# Altium project TIDA-010086_mod.PrjPcb (part 4 of 11)
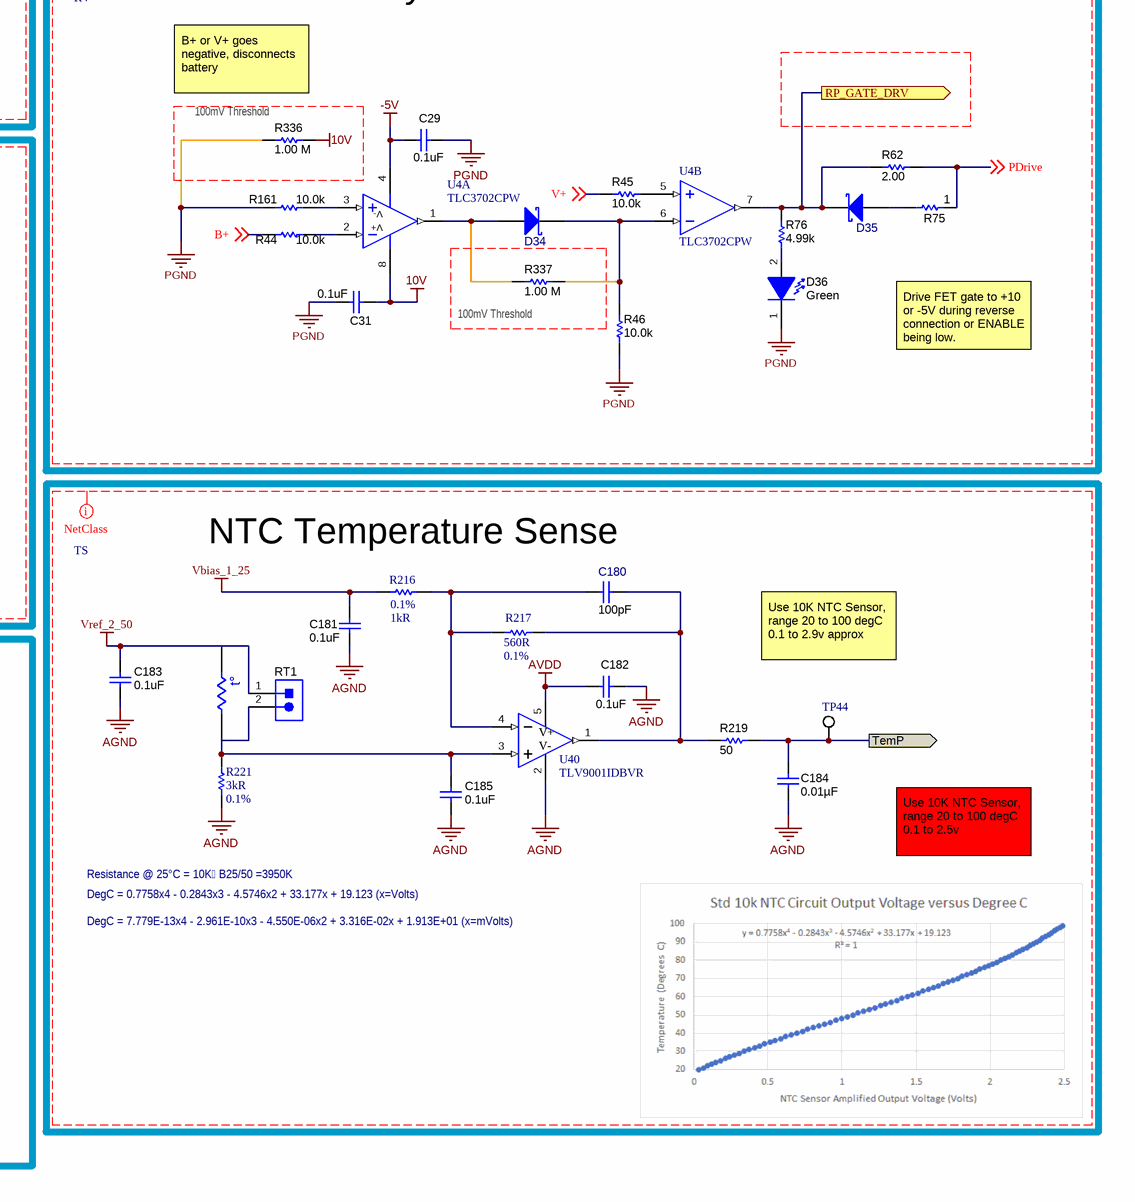
[diagram p120: XTIDA-010086_Power Stage.SchDoc, bottom right]

## Sheet XTIDA-010086_Power Stage.SchDoc: Power Stage (continued)
### Library data of the parts
C1 = C0603C104J3RACTU: CAP, CERM, 0.1 µF, 25 V, +/- 5%, X7R, 0603; Manufacturer: Kemet; Polarized: N; CompType: Capacitor; Value: 0.1uF; U/M: EA; Cap_F: 0.0000001; Tolerance_%: 5; Value1: Unknown; VDC_V: 25; Value2: 25V; TaMin_C: -55; TaMax_C: 125; Cap_Case: 0603; SizeArea_mm2: 1.28; SizeAreaWB_mm2: 4.68; SizeX_mm: 1.6; SizeY_mm: 0.8; SizeZ_mm: 1; AEC Category: Q200; AEC Qualified: Y; SymbolVersion: 2008-07-09; PartNumber: C0603C104J3RACTU; PackageReference: 0603; RoHS: Y; MountType: SMT; Technology: Ceramic; TempCo: X7R; Published: 2008-06-19; Publisher: Texas Instruments; LatestRevisionDate: 2016-09-23; ComponentLink1Description: Datasheet link; ComponentLink1URL: http://www.kemet.com/kemet/web/homepage/kechome.nsf/vapubfiles/F3102_Y5V.pdf/$file/F3102_Y5V.pdf; Supplier 1: Digi-Key; Supplier Part Number 1: 399-1282-1-ND; Supplier 2: Mouser; Supplier Part Number 2: 80-C0603C104J3R; Supplier 3: Farnell; Supplier Part Number 3: 1650833
C2 = GRM1885C1H101JA01D: CAP, CERM, 100 pF, 50 V, +/- 5%, C0G/NP0, 0603; Manufacturer: MuRata; Polarized: N; CompType: Capacitor; Value: 100pF; U/M: EA; Cap_F: 0.0000000001; Tolerance_%: 5; Value1: Unknown; VDC_V: 50; TaMin_C: -55; TaMax_C: 125; Cap_Case: 0603; SizeArea_mm2: 1.28; SizeAreaWB_mm2: 4.68; SizeX_mm: 1.6; SizeY_mm: 0.8; SizeZ_mm: 1; AEC Category: Q200; SymbolVersion: 2008-07-09; PartNumber: GRM1885C1H101JA01D; PackageReference: 0603; RoHS: Y; MountType: SMT; Technology: Ceramic; TempCo: C0G/NP0; Published: 2008-06-19; Publisher: Texas Instruments; LatestRevisionDate: 2016-12-20; ComponentLink1Description: Datasheet link; ComponentLink1URL: http://search.murata.co.jp/Ceramy/PnsearchViewAction.do?HnOFG=ON&HnNFG=ON&SEL_CNT=50&sLang=en&sKey=GRM1885C1H101JA01D&x=9&y=9&search=startwith; Supplier 1: Digi-Key; Supplier Part Number 1: 490-1427-1-ND; Supplier 2: Mouser; Supplier Part Number 2: 81-GRM39C101J50; Supplier 3: Farnell; Supplier Part Number 3: 8819866; AEC Qualified: ?
C3 = 25SVPF330M: 330µF 35V Aluminum Polymer Capacitor Radial, Can - SMD 18mOhm 1000 Hrs @ 125°C; Manufacturer: Panasonic; Polarized: Y; Value: 330uF; U/M: EA; Cap_F: 0.00033; Tolerance_%: 20; Value1: 0.014 ohm; VDC_V: 35; ESR_ohm: 0.014; IRMS_A: 5; TaMin_C: -55; TaMax_C: 105; Cap_Case: F12; SizeAreaWB_mm2: 151.29; SizeArea_mm2: 106.09; SizeX_mm: 10.3; SizeZ_mm: 12.6; AEC Category: Q200; AEC Qualified: N; CompType: Capacitor; SymbolVersion: 2008-07-09; PartNumber: 35SVPK330M; PackageReference: F12, SMD, 2-Leads, Body 10.5x10.5mm, Height 12.7mm; RoHS: Y; MountType: SMT; Technology: Aluminum Polymer; Series: SVPF; SizeY_mm: 10.3; Publisher: Texas Instruments; LatestRevisionDate: 2016-12-22; ComponentLink1Description: Datasheet link; ComponentLink1URL: http://industrial.panasonic.com/www-data/pdf/AAB8000/AAB8000CE1.pdf; Supplier 1: Digi-Key; Supplier Part Number 1: P122136TR-ND; AEC Grade: N/A
C4-C6 = GRM32ER71E226KE15L: CAP, CERM, 22 µF, 25 V, +/- 10%, X7R, 1210; Manufacturer: MuRata; Polarized: N; CompType: Capacitor; Value: 22uF; U/M: EA; Cap_F: 0.000022; Tolerance_%: 10; Value1: Unknown; VDC_V: 25; TaMin_C: -55; TaMax_C: 125; Cap_Case: 1210; SizeArea_mm2: 8; SizeAreaWB_mm2: 14.7; SizeX_mm: 3.2; SizeY_mm: 2.5; SizeZ_mm: 2.7; AEC Category: Q200; SymbolVersion: 2008-07-09; PartNumber: GRM32ER71E226KE15L; PackageReference: 1210; RoHS: Y; MountType: SMT; Technology: Ceramic; TempCo: X7R; Published: 2008-06-19; Publisher: Texas Instruments; LatestRevisionDate: 2016-09-23; ComponentLink1Description: Datasheet link; ComponentLink1URL: http://search.murata.co.jp/Ceramy/PnsearchViewAction.do?HnOFG=ON&HnNFG=ON&SEL_CNT=50&sLang=en&sKey=GRM32ER71E226KE15L&x=9&y=9&search=startwith; Supplier 1: Digi-Key; Supplier Part Number 1: 490-5313-1-ND; Supplier 2: Mouser; Supplier Part Number 2: 81-GRM32ER71E226KE5L; Supplier 3: Farnell; Supplier Part Number 3: 1797019; AEC Qualified: ?
C7 C11 C20 C23 = Capacitor: CAP, CERM, 0.1 uF, 25 V, +/- 5%, X7R, 0603; Manufacturer: AVX; Polarized: N; Value: 0.1uF; U/M: EA; Cap_F: 100nF; ESR_ohm: 0.05; Value1: 0.05 ohm; TaMin_C: -55°C; TaMax_C: 125°C; AEC Category: Q200; SizeArea_mm2: 1.28; SizeAreaWB_mm2: 4.68; SizeX_mm: 1.6; SizeY_mm: 0.8; SizeZ_mm: 1; CompType: Capacitor; PartNumber: 06033C104JAT2A; PackageReference: 0603; RoHS: Y; Tolerance_%: 5%; VDC_V: 25V; MountType: SMT; Technology: Ceramic; TempCo: X7R; Cap_Case: 0603; Published: 2008-06-19; Publisher: Texas Instruments; LatestRevisionDate: 2017-03-09; ComponentLink1Description: Datasheet link; ComponentLink1URL: http://datasheets.avx.com/X7RDielectric.pdf; Supplier 1: Digi-Key; Supplier Part Number 1: 478-3713-1-ND; Supplier 2: Mouser; Supplier Part Number 2: 581-06033C104JAT2A; Supplier 3: Farnell; Supplier Part Number 3: 1740614; AEC Qualified: N; AEC Grade: N/A
C8 C18 C24 C52 = Capacitor: CAP, CERM, 1 uF, 25 V, +/- 10%, X7R, 0603; Manufacturer: MuRata; Polarized: N; Value: 1uF; U/M: EA; Cap_F: 1µF; Value1: Unknown; TaMin_C: -55°C; TaMax_C: 125°C; AEC Category: Q200; SizeArea_mm2: 1.28; SizeAreaWB_mm2: 4.68; SizeX_mm: 1.6; SizeY_mm: 0.8; SizeZ_mm: 1; CompType: Capacitor; PartNumber: GRM188R71E105KA12D; PackageReference: 0603; RoHS: Y; Tolerance_%: 10%; MountType: SMT; Technology: Ceramic; TempCo: X7R; Cap_Case: 0603; Published: 2008-06-19; Publisher: Texas Instruments; LatestRevisionDate: 2017-03-09; ComponentLink1Description: Datasheet link; ComponentLink1URL: http://search.murata.co.jp/Ceramy/PnsearchViewAction.do?HnOFG=ON&HnNFG=ON&SEL_CNT=50&sLang=en&sKey=GRM188R71E105KA12D&x=9&y=9&search=startwith; Supplier 1: Digi-Key; Supplier Part Number 1: 490-5307-1-ND; Supplier 2: Mouser; Supplier Part Number 2: 81-GRM188R71E105KA2D; Supplier 3: Farnell; Supplier Part Number 3: 1735540; AEC Qualified: ?
  C8 C18: Value2: 25V
  C24 C52: VDC_V: 25V; Parameter 1: *
C9 C10 = 10SVP560M: 560µF 20V Aluminum Polymer Capacitor Radial, Can - SMD 12mOhm 1000 Hrs @ 125°C; Manufacturer: Panasonic; Polarized: Y; Value: 560uF; U/M: EA; Cap_F: 0.00056; Tolerance_%: 20; Value1: 0.013 ohm; ESR_ohm: 0.013; IRMS_A: 5.23; TaMin_C: -55; TaMax_C: 105; Cap_Case: 10.3x10.3x12.6; SizeAreaWB_mm2: 159.9; SizeArea_mm2: 113.3; SizeX_mm: 11; SizeY_mm: 10.3; SizeZ_mm: 7.7; AEC Category: Q200; CompType: Capacitor; SymbolVersion: 2008-07-09; PartNumber: 20SVF560M; PackageReference: 10x10.3; RoHS: Y; VDC_V: 20; MountType: SMT; Technology: Aluminum Polymer; Series: SVP; Publisher: Texas Instruments; LatestRevisionDate: 2016-09-20; ComponentLink1Description: Datasheet link; ComponentLink1URL: https://industrial.panasonic.com/content/data/CP/PDF/OS-CON/S_OS-CON_SVP_e.pdf; Supplier 1: Digi-Key; Supplier Part Number 1: P122119TR-ND; AEC Qualified: ?
C12 C13 = GRM32ER71A476ME15L: CAP, CERM, 47 µF, 10 V, +/- 20%, X7R, 1210; Manufacturer: MuRata; Polarized: N; CompType: Capacitor; Value: 47uF; U/M: EA; Cap_F: 0.000047; Tolerance_%: 20; Value1: Unknown; VDC_V: 10; TaMin_C: -55; TaMax_C: 125; Cap_Case: 1210; SizeArea_mm2: 8; SizeAreaWB_mm2: 14.7; SizeX_mm: 3.2; SizeY_mm: 2.5; SizeZ_mm: 2.7; AEC Category: Q200; SymbolVersion: 2008-07-09; PartNumber: GRM32ER71A476ME15L; PackageReference: 1210; RoHS: Y; MountType: SMT; Technology: Ceramic; TempCo: X7R; Published: 2008-06-19; Publisher: Texas Instruments; LatestRevisionDate: 2016-09-23; ComponentLink1Description: Datasheet link; ComponentLink1URL: http://search.murata.co.jp/Ceramy/image/img/A01X/G101/ENG/GRM32ER71A476ME15-01.pdf; Supplier 1: Digi-Key; Supplier Part Number 1: 490-6543-1-ND; Supplier 2: Mouser; Supplier Part Number 2: 81-GRM32ER71A476ME5L; Supplier 3: Farnell; Supplier Part Number 3: 2362130; AEC Qualified: ?
C14 C25 C29 C31 C36 C45 C53 C166 C167 C174 C181-C183 C185 = Capacitor: CAP, CERM, 0.1 uF, 25 V, +/- 5%, X7R, 0603; Manufacturer: AVX; Polarized: N; Value: 0.1uF; U/M: EA; Cap_F: 100nF; ESR_ohm: 0.05; Value1: 0.05 ohm; VDC_V: 25V; TaMin_C: -55°C; TaMax_C: 125°C; AEC Category: Q200; SizeArea_mm2: 1.28; SizeAreaWB_mm2: 4.68; SizeX_mm: 1.6; SizeY_mm: 0.8; SizeZ_mm: 1; CompType: Capacitor; PartNumber: 06033C104JAT2A; PackageReference: 0603; RoHS: Y; Tolerance_%: 5%; Value2: 25V; MountType: SMT; Technology: Ceramic; TempCo: X7R; Cap_Case: 0603; Published: 2008-06-19; Publisher: Texas Instruments; LatestRevisionDate: 2017-03-09; ComponentLink1Description: Datasheet link; ComponentLink1URL: http://datasheets.avx.com/X7RDielectric.pdf; Supplier 1: Digi-Key; Supplier Part Number 1: 478-3713-1-ND; Supplier 2: Mouser; Supplier Part Number 2: 581-06033C104JAT2A; Supplier 3: Farnell; Supplier Part Number 3: 1740614; AEC Qualified: N; AEC Grade: N/A
C15 C19 C180 = GRM1885C1H102JA01D: CAP, CERM, 100 pF, 50 V, +/- 5%, C0G/NP0, 0603; Manufacturer: MuRata; Polarized: N; CompType: Capacitor; Value: 100pF; U/M: EA; Cap_F: 0.0000000001; Tolerance_%: 5; Value1: Unknown; VDC_V: 50; Value2: 50V; TaMin_C: -55; TaMax_C: 125; Cap_Case: 0603; SizeArea_mm2: 1.28; SizeAreaWB_mm2: 4.68; SizeX_mm: 1.6; SizeY_mm: 0.8; SizeZ_mm: 1; AEC Category: Q200; SymbolVersion: 2008-07-09; PartNumber: GRM1885C1H101JA01D; PackageReference: 0603; RoHS: Y; MountType: SMT; Technology: Ceramic; TempCo: C0G/NP0; Published: 2008-06-19; Publisher: Texas Instruments; LatestRevisionDate: 2017-03-17; ComponentLink1Description: Datasheet link; ComponentLink1URL: http://search.murata.co.jp/Ceramy/PnsearchViewAction.do?HnOFG=ON&HnNFG=ON&SEL_CNT=50&sLang=en&sKey=GRM1885C1H102JA01D&x=9&y=9&search=startwith; AEC Qualified: ?
C16 C33 C48 C147 C151 = GRM155R71H122KA01D: CAP, CERM, 1200 pF, 50 V,+/- 10%, X7R, 0402; Manufacturer: MuRata; Polarized: N; CompType: Capacitor; Value: 1200pF; U/M: EA; Cap_F: 0.0000000012; Tolerance_%: 10; VDC_V: 50; Value2: 50V; TaMin_C: -55; TaMax_C: 125; SizeArea_mm2: 0.5; SizeAreaWB_mm2: 3; SizeX_mm: 1; SizeZ_mm: 0.6; AEC Category: Q200; SymbolVersion: 2008-07-09; PartNumber: GRM155R71H122KA01D; PackageReference: 0402; RoHS: Y; MountType: SMT; Technology: Ceramic; TempCo: X7R; Cap_Case: 0402; SizeY_mm: 0.5; Published: 2008-06-19; Publisher: Texas Instruments; LatestRevisionDate: 2017-06-22; ComponentLink1Description: Datasheet link; ComponentLink1URL: http://search.murata.co.jp/Ceramy/PnsearchViewAction.do?HnOFG=ON&HnNFG=ON&SEL_CNT=50&sLang=en&sKey=GRM155R71H122KA01D&x=9&y=9&search=startwith; Supplier 1: Digi-Key; Supplier Part Number 1: 490-1304-1-ND; Supplier 2: Mouser; Supplier Part Number 2: 81-GRM15R71H122KA01D; AEC Qualified: ?
C17 C28 C40 C184 = C0603C103J3GECAUTO: CAP, CERM, 0.01 µF, 25 V,+/- 5%, C0G/NP0, AEC-Q200 Grade 1, 0603; Manufacturer: Kemet; Polarized: N; CompType: Capacitor; Value: 0.01uF; U/M: EA; Cap_F: 0.00000001; Tolerance_%: 5; VDC_V: 25; Value2: 25V; TaMin_C: -55; TaMax_C: 125; SizeArea_mm2: 1.28; SizeAreaWB_mm2: 4.68; SizeX_mm: 1.6; SizeY_mm: 0.8; SizeZ_mm: 1; AEC Category: Q200; AEC Qualified: Y; SymbolVersion: 2008-07-09; PartNumber: C0603C103J3GECAUTO; PackageReference: 0603; RoHS: Y; MountType: SMT; Technology: Ceramic; TempCo: C0G/NP0; Cap_Case: 0603; Published: 2008-06-19; Publisher: Texas Instruments; LatestRevisionDate: 2017-06-22; ComponentLink1Description: Datasheet link; ComponentLink1URL: https://search.kemet.com/component-edge/download/datasheet/C0603C103J3GECAUTO.pdf; Supplier 1: Digi-Key; Supplier Part Number 1: 399-14102-1-ND; Supplier 2: Newark; Supplier Part Number 2: 06AC5972; Supplier 3: Mouser; Supplier Part Number 3: 80-C0603C103J3GEAUTO; AEC Grade: 1
C21 C22 C171 C172 = GRM1885C1H101JA01D: CAP, CERM, 100 pF, 50 V, +/- 5%, C0G/NP0, 0603; Manufacturer: MuRata; Polarized: N; CompType: Capacitor; ValueDisplayed: 100pF; U/M: EA; Cap_F: 0.0000000001; Tolerance_%: 5; Value1: Unknown; VDC_V: 50; Value2: 50V; TaMin_C: -55; TaMax_C: 125; Cap_Case: 0603; SizeArea_mm2: 1.28; SizeAreaWB_mm2: 4.68; SizeX_mm: 1.6; SizeY_mm: 0.8; SizeZ_mm: 1; AEC Category: Q200; SymbolVersion: 2008-07-09; PartNumber: GRM1885C1H101JA01D; PackageReference: 0603; RoHS: Y; MountType: SMT; Technology: Ceramic; TempCo: C0G/NP0; Published: 2008-06-19; Publisher: Texas Instruments; LatestRevisionDate: 2016-09-23; ComponentLink1Description: Datasheet link; ComponentLink1URL: http://search.murata.co.jp/Ceramy/PnsearchViewAction.do?HnOFG=ON&HnNFG=ON&SEL_CNT=50&sLang=en&sKey=GRM1885C1H101JA01D&x=9&y=9&search=startwith; Supplier 1: Digi-Key; Supplier Part Number 1: 490-1427-1-ND; Supplier 2: Mouser; Supplier Part Number 2: 81-GRM39C101J50; Supplier 3: Farnell; Supplier Part Number 3: 8819866; AEC Qualified: ?
C26 C27 = 885012205044: CAP, CERM, 1000 pF, 25 V,+/- 10%, X7R, 0402; Manufacturer: Wurth Elektronik; Polarized: N; CompType: Capacitor; Value: 1000pF; U/M: EA; Cap_F: 0.000000001; Tolerance_%: 10; VDC_V: 25; Value2: 25V; TaMin_C: -55; TaMax_C: 125; SizeArea_mm2: 0.5; SizeAreaWB_mm2: 3; SizeX_mm: 1; SizeZ_mm: 0.6; AEC Category: Q200; SymbolVersion: 2008-07-09; PartNumber: 885012205044; PackageReference: 0402; RoHS: Y; MountType: SMT; Technology: Ceramic; TempCo: X7R; Cap_Case: 0402; SizeY_mm: 0.5; Published: 2008-06-19; Publisher: Texas Instruments; LatestRevisionDate: 2017-06-22; ComponentLink1Description: Datasheet link; ComponentLink1URL: http://katalog.we-online.de/pbs/datasheet/885012205044.pdf; Supplier 1: Mouser; Supplier Part Number 1: 710-885012205044; AEC Qualified: N; AEC Grade: N/A
C35 C50 C178 = GRM2195C1H752JA01D: CAP, CERM, 7500 pF, 50 V,+/- 5%, C0G/NP0, 0805; Manufacturer: MuRata; Polarized: N; CompType: Capacitor; Value: 7500pF; U/M: EA; Cap_F: 0.0000000075; Tolerance_%: 5; VDC_V: 50; Value2: 50V; TaMin_C: -55; TaMax_C: 125; Cap_Case: 0805; SizeArea_mm2: 2.5; SizeAreaWB_mm2: 6.75; SizeX_mm: 2; SizeY_mm: 1.25; SizeZ_mm: 1.45; AEC Category: Q200; SymbolVersion: 2008-07-09; PartNumber: GRM2195C1H752JA01D; PackageReference: 0805; RoHS: Y; MountType: SMT; Technology: Ceramic; TempCo: C0G/NP0; Published: 2008-06-19; Publisher: Texas Instruments; LatestRevisionDate: 2017-06-22; ComponentLink1Description: Datasheet link; ComponentLink1URL: http://search.murata.co.jp/Ceramy/PnsearchViewAction.do?HnOFG=ON&HnNFG=ON&SEL_CNT=50&sLang=en&sKey=GRM2195C1H752JA01D&x=9&y=9&search=startwith; Supplier 1: Digi-Key; Supplier Part Number 1: 490-1639-1-ND; Supplier 2: Mouser; Supplier Part Number 2: 81-GRM2195C1H752JA1D; AEC Qualified: ?
C37-C39 C49 C170 = GRM1885C1H102JA01D: CAP, CERM, 1000 pF, 50 V, +/- 5%, C0G/NP0, 0603; Manufacturer: MuRata; Polarized: N; CompType: Capacitor; Value: 1000pF; U/M: EA; Cap_F: 0.000000001; Tolerance_%: 5; Value1: Unknown; VDC_V: 50; Value2: 50V; TaMin_C: -55; TaMax_C: 125; Cap_Case: 0603; SizeArea_mm2: 1.28; SizeAreaWB_mm2: 4.68; SizeX_mm: 1.6; SizeY_mm: 0.8; SizeZ_mm: 1; AEC Category: Q200; SymbolVersion: 2008-07-09; PartNumber: GRM1885C1H102JA01D; PackageReference: 0603; RoHS: Y; MountType: SMT; Technology: Ceramic; TempCo: C0G/NP0; Published: 2008-06-19; Publisher: Texas Instruments; LatestRevisionDate: 2017-03-17; ComponentLink1Description: Datasheet link; ComponentLink1URL: http://search.murata.co.jp/Ceramy/PnsearchViewAction.do?HnOFG=ON&HnNFG=ON&SEL_CNT=50&sLang=en&sKey=GRM1885C1H102JA01D&x=9&y=9&search=startwith; Supplier 1: Digi-Key; Supplier Part Number 1: 490-1451-1-ND; Supplier 2: Mouser; Supplier Part Number 2: 81-GRM39C102J50; Supplier 3: Farnell; Supplier Part Number 3: 8819920; AEC Qualified: ?
C54 = Capacitor: CAP, CERM, 0.1 uF, 25 V, +/- 5%, X7R, 0603; Manufacturer: AVX; Polarized: N; U/M: EA; Cap_F: 100nF; ESR_ohm: 0.05; Value1: 0.05 ohm; VDC_V: 25V; TaMin_C: -55°C; TaMax_C: 125°C; AEC Category: Q200; SizeArea_mm2: 1.28; SizeAreaWB_mm2: 4.68; SizeX_mm: 1.6; SizeY_mm: 0.8; SizeZ_mm: 1; CompType: Capacitor; PartNumber: 06033C104JAT2A; PackageReference: 0603; RoHS: Y; Tolerance_%: 5%; Value2: 25V; MountType: SMT; Technology: Ceramic; TempCo: X7R; Cap_Case: 0603; Published: 2008-06-19; Publisher: Texas Instruments; LatestRevisionDate: 2017-03-09; ComponentLink1Description: Datasheet link; ComponentLink1URL: http://datasheets.avx.com/X7RDielectric.pdf; Supplier 1: Digi-Key; Supplier Part Number 1: 478-3713-1-ND; Supplier 2: Mouser; Supplier Part Number 2: 581-06033C104JAT2A; Supplier 3: Farnell; Supplier Part Number 3: 1740614; AEC Qualified: N; AEC Grade: N/A; ValueDisplayed: 0.1uF
C168 = GRM1885C1H102JA01D: CAP, CERM, 10 pF, 50 V, +/- 5%, C0G/NP0, 0603; Manufacturer: MuRata; Polarized: N; CompType: Capacitor; Value: 10pF; U/M: EA; Cap_F: 0.00000000001; Tolerance_%: 5; Value1: Unknown; VDC_V: 50; Value2: 50V; TaMin_C: -55; TaMax_C: 125; Cap_Case: 0603; SizeArea_mm2: 1.28; SizeAreaWB_mm2: 4.68; SizeX_mm: 1.6; SizeY_mm: 0.8; SizeZ_mm: 1; AEC Category: Q200; SymbolVersion: 2008-07-09; PackageReference: 0603; RoHS: Y; MountType: SMT; Technology: Ceramic; TempCo: C0G/NP0; Published: 2008-06-19; Publisher: Texas Instruments; LatestRevisionDate: 2017-03-17; ComponentLink1Description: Datasheet link; ComponentLink1URL: http://search.murata.co.jp/Ceramy/PnsearchViewAction.do?HnOFG=ON&HnNFG=ON&SEL_CNT=50&sLang=en&sKey=GRM1885C1H102JA01D&x=9&y=9&search=startwith; AEC Qualified: ?; PartNumber: GRM1885C1H100JA01D; Supplier 1: Digi-Key; Supplier Part Number 1: 490-1403-1-ND
C177 C179 = Capacitor: CAP, CERM, 1 uF, 25 V, +/- 10%, X7R, 0603; Manufacturer: MuRata; Polarized: N; Value: 1uF; U/M: EA; Cap_F: 1µF; Value1: Unknown; VDC_V: 25V; TaMin_C: -55°C; TaMax_C: 125°C; AEC Category: Q200; SizeArea_mm2: 1.28; SizeAreaWB_mm2: 4.68; SizeX_mm: 1.6; SizeY_mm: 0.8; SizeZ_mm: 1; CompType: Capacitor; PartNumber: GRM188R71E105KA12D; PackageReference: 0603; RoHS: Y; Tolerance_%: 10%; Value2: 25V; MountType: SMT; Technology: Ceramic; TempCo: X7R; Cap_Case: 0603; Published: 2008-06-19; Publisher: Texas Instruments; LatestRevisionDate: 2017-03-09; ComponentLink1Description: Datasheet link; ComponentLink1URL: http://search.murata.co.jp/Ceramy/PnsearchViewAction.do?HnOFG=ON&HnNFG=ON&SEL_CNT=50&sLang=en&sKey=GRM188R71E105KA12D&x=9&y=9&search=startwith; Supplier 1: Digi-Key; Supplier Part Number 1: 490-5307-1-ND; Supplier 2: Mouser; Supplier Part Number 2: 81-GRM188R71E105KA2D; Supplier 3: Farnell; Supplier Part Number 3: 1735540; AEC Qualified: ?; Parameter 1: *
D1 D3 D4 D34 D35 = NSR0240V2T1G: Diode, Schottky, 40V, 0.25A, SOD-523; Manufacturer: ON Semiconductor; U/M: EA; Vf_V: 0.7; Value2: 0.7V; Io_A: 0.25; Vr_V: 40; TJmax_C: 150; RJC_CperW: 600; CompType: Diode; SymbolVersion: 2008-12-08; PartNumber: NSR0240V2T1G; PackageReference: SOD-523; Value: 40V; Value1: 0.25A; MountType: SMT; Type: Schottky; RoHS: Y; Published: 2008-06-26; Publisher: Texas Instruments; LatestRevisionDate: 2014-07-21; ComponentLink1Description: Datasheet link; ComponentLink1URL: http://www.onsemi.com/pub_link/Collateral/NSR0240V2T1-D.PDF; Supplier 1: Digi-Key; Supplier Part Number 1: NSR0240V2T1GOSCT-ND; Supplier 2: Mouser; Supplier Part Number 2: 863-NSR0240V2T1G; Supplier 3: Newark; Supplier Part Number 3: 46P8323
D2 = VS-20WT04FN: Diode FERD (Field Effect Rectifier Diode) 100V 20A Surface Mount DPAK; Manufacturer: STMicroelectronics; U/M: EA; Vf_V: 0.53; Value: 45V; Value2: 0.53V; Io_A: 20; Vr_V: 45; TJmax_C: 175; RJC_CperW: 1.2; Type: Schottky; SizeAreaWB_mm2: 101.7114; SizeArea_mm2: 64.8114; SizeX_mm: 9.91; SizeY_mm: 6.54; SizeZ_mm: 2.29; AEC Category: Q101; Green_Lifecycle: Not Set; Green_REACh: Incomplete; SymbolVersion: 2010-03-23; PartNumber: FERD20H100SB-TR; PackageReference: DPAK; CompType: Diode; Value1: 20A; MountType: SMT; RoHS: Y; Published: 2008-06-26; Publisher: Texas Instruments; ComponentLink1Description: Datasheet link; ComponentLink1URL: http://www.vishay.com/docs/94573/vs20uwt04f.pdf; Supplier 1: Digi-Key; Supplier Part Number 1: 497-16946-2-ND; AEC Qualified: ?; Green_EU RoHS: Incomplete; Green_EU RoHS-2: Incomplete
D36 = 150060VS75000: LED, Green, SMD; Manufacturer: Wurth Elektronik; Type: AlInGaP; Vf_V: 2; Value2: 2V; Io_A: 0.02; Value1: W; U/M: EA; CompType: LED; PartNumber: 150060VS75000; SymbolVersion: 2008-11-06; MountType: SMT; RoHS: Y; PackageReference: LED_0603; Color: green; Published: 2008-07-11; Publisher: Texas Instruments; ComponentLink1URL: http://katalog.we-online.de/led/datasheet/150060VS75000.pdf; ComponentLink1Description: Datasheet link; LatestRevisionDate: 2016-01-08; Supplier 1: Digi-Key; Supplier Part Number 1: 732-4980-1-ND
F1 = 6125FA15A: Fuse, 15 A, SMD; Manufacturer: Cooper Bussman; Irating_A: 15; Rtyp_Ohm: 0.004; MeltingTyp: 124; SymbolVersion: 2008-07-09; PartNumber: 6125FA15A; PackageReference: 6125FA; MountType: SMT; CompType: Fuse; RoHS: Y; Published: 2009-03-05; Publisher: Texas Instruments; LatestRevisionDate: 2017-05-15; ComponentLink1Description: Datasheet URL; ComponentLink1URL: http://www.cooperindustries.com/content/dam/public/bussmann/Electronics/Resources/product-datasheets/Bus_Elx_DS_OC-2531_6125FA_Series.pdf
J1 J3 = SYM-5502-14-0030: Terminal Connector Rectangular Lug, Grounding 10-14 AWG 1/8 Stud; Manufacturer: Panduit; Symbol Name: SYM-CB25-18-CY; ContactFinish: Zinc; Voltage_V: 600V; Current_A: 25A; ComponentLink1Description: Datasheet; PinCount: 1; ComponentLink1URL: https://www.panduit.com/content/dam/panduit/en/products/media/2/02/802/3802/109803802.pdf; PackageReference: CONN_TERM_LUG_25MM4_7MM9; PartNumber: CB25-18-CY; RoHS: TRUE
J2 RT1#1 = B2B-EH-A(LF)(SN): Header (Shrouded), 2.5mm, 2x1, Tin, TH; Manufacturer: JST Manufacturing; SymbolCreator: a0412235; Pitch_mm: 2.5; Gender: Male; Shrouded: Y; Row_Count: 1; Current_A: 3; Voltage_V: 250; SymbolVersion: 2013-10-31; PartNumber: B2B-EH-A(LF)(SN); PackageReference: Header (Shrouded), 2.5mm, 2x1, TH; CompType: Header; RoHS: Y; MountType: TH; ComponentLink1Description: Datasheet URL; ComponentLink1URL: http://www.jst-mfg.com/product/pdf/eng/eEH.pdf; Orientation: Vertical; PinCount: 2; ContactFinish: Tin; Color: White; Cert_CSA: Y; Cert_UL: Y; Publisher: Texas Instruments; LatestRevisionDate: 2017-06-26; Supplier 1: Digi-Key; Supplier 2: RSComponents
  RT1#1: Supplier Part Number 1: 455-1611-ND; Supplier Part Number 2: 5151383
L1 = Inductor_Iron: Inductor, Shielded Drum Core, Powdered Iron, 1 uH, 5 A, 0.022 ohm, SMD; Manufacturer: Wurth Elektronik; Isat: 9A @ 20% inductance drop; Irms: 5A @ 40C rise; Green_Lifecycle: Active; SizeAreaWB_mm2: 27.577; DCR_ohm: 0.022; Green_REACh: Passed; Value: 1uH; Imax_A: 5A; SizeZ_mm: 2; SizeX_mm: 4.45; SizeY_mm: 4.06; SizeArea_mm2: 18.067; Ind_H: 1µH; AEC Category: Q200; ComponentLink1URL: http://katalog.we-online.de/kataloge/eisos/media/pdf/74437324010.pdf; Publisher: Texas Instruments; Published: 2008-06-26; RoHS: Y; Value1: 0.022 ohm; Material: Powdered Iron; MountType: SMT; Green_EU RoHS-2: Incomplete; Supplier 1: Digi-Key; Green_EU RoHS: Passed; PackageReference: 4.45x1.8x4.06mm; Value2: 5A; CompType: Inductor; LatestRevisionDate: 2017-06-02; PartNumber: 74437324010; AEC Qualified: ?; ComponentLink1Description: Datasheet link; Supplier Part Number 1: 732-3342-1-ND; Technology: Shielded Drum Core
L2 = Inductor_Iron: Inductor, Shielded, Mn-Zn, 47 µH, 13 A, 0.00968 ohm, SMD; Manufacturer: Wurth Elektronik; SizeY_mm: 28; SizeZ_mm: 20.5; SizeAreaWB_mm2: 810; Value2: 13A; SizeArea_mm2: 700; Isat: 13A @ 30% inductance drop; AEC Qualified: N; DCR_ohm: 9.68m; AEC Category: Q200; Value: 47uH; SizeX_mm: 25; Irms: 18.7A @ 50C rise; Technology: Shielded; Value1: 0.00968 ohm; CompType: Inductor; Ind_H: 47µH; Imax_A: 13A; AEC Grade: N/A; ComponentLink1URL: http://katalog.we-online.de/pbs/datasheet/74437529203470.pdf; Material: Mn-Zn; MountType: SMT; RoHS: Y; PackageReference: SMT High Current Inductor; ComponentLink1Description: Datasheet link; PartNumber: 74437529203470; Supplier 1: Digi-Key
Q1 Q7 = MOSFET_N_D56789G4S123: MOSFET, N-CH, 40 V, 15 A, DQJ0008A (VSONP-8); Alternate Manufacturer: None; Manufacturer: Texas Instruments; SizeZ_mm: 1.1; ChType: N; Value2: 7.7 nC; Value1: 0.009; VdsMax_V: 40V; SizeX_mm: 6; SizeY_mm: 4.9; Vgs_V: 20V; Value: 40V; Rdson45_ohm: 9.8m; SizeArea_mm2: 29.4; AEC Category: Q101; IdsMax_A: 15A; SizeAreaWB_mm2: 55.2; U/M: EA; QgTyp_nC: 7.7; Supplier 2: Mouser; Supplier 1: Digi-Key; Supplier Part Number 1: 296-30572-1-ND; Supplier Part Number 2: 595-CSD18504Q5A; PartNumber: CSD18504Q5A; ComponentLink1Description: Datasheet link; LatestRevisionDate: 2017-03-09; ComponentLink1URL: http://www.ti.com/lit/ds/symlink/csd18504q5a.pdf; CompType: MOSFET; PackageReference: DQJ0008A; LatestRevisionNote: Added parts.; Publisher: Texas Instruments; AEC Qualified: N; Published: 2008-06-19; RoHS: Y; MountType: SMT
Q8 = CSD16570Q5B: MOSFET, N-CH, 25 V, 100 A, DNK0008A (VSON-CLIP-8); Manufacturer: Texas Instruments; Alternate Manufacturer: None; U/M: EA; ChType: N; Value: 25V; VdsMax_V: 25; Value1: 0.0008 ohm; Rdson45_ohm: 0.0008; Value2: 192 nC; QgTyp_nC: 192; Vgs_V: 20; IdsMax_A: 100; SizeAreaWB_mm2: 56; SizeArea_mm2: 30; SizeX_mm: 6; SizeY_mm: 5; SizeZ_mm: 1; AEC Category: Q101; SymbolVersion: 2011-08-16; PartNumber: CSD16570Q5B; PackageReference: DNK0008A; CompType: MOSFET; RoHS: Y; MountType: SMT; Published: 2008-06-19; Publisher: Texas Instruments; LatestRevisionDate: 2017-03-20; LatestRevisionNote: Added parts.; ComponentLink1Description: Datasheet link; ComponentLink1URL: http://www.ti.com/lit/ds/symlink/csd16570q5b.pdf; Supplier 1: Digi-Key; Supplier Part Number 1: CSD16570Q5B-ND; Supplier 2: Newark; Supplier Part Number 2: 83X7113; Supplier 3: Mouser; Supplier Part Number 3: 595-CSD16570Q5B; AEC Qualified: N
R1 R5 R18 R24 R44-R46 R161 = Resistor: RES, 10.0 k, 1%, 0.1 W, 0603; Manufacturer: Yageo; Power_W: 100mW; TempCo: 100 ppm/C; Value_Code: 10k0; Value: 10.0k; EIA_Code: E96; Res_ohm: 10k; SizeX_mm: 1.6; SizeY_mm: 0.8; SizeZ_mm: 1; Value2: 0.1W; SizeArea_mm2: 1.28; AEC Qualified: N; VDC_V: 75V; AEC Category: Q200; SizeAreaWB_mm2: 4.68; Supplier Part Number 2: 603-RC0603FR-0710KL; Supplier 2: Mouser; Supplier Part Number 3: 9238603; Supplier 3: Farnell; RoHS: Y; Value1: 1%; MountType: SMT; Supplier 1: Digi-Key; PackageReference: 0603; Tolerance_%: 1%; CompType: Resistor; PartNumber: RC0603FR-0710KL; ComponentLink1Description: Datasheet link; Supplier Part Number 1: 311-10.0KHRCT-ND; Technology: Thick Film; ComponentLink1URL: http://www.yageo.com/pdf/Pu-RC0603_51_PbFree_L_2.pdf; AEC Grade: N/A
R2 R3 R8 = RC0603JR-070RL: RES, 0, 5%, 0.1 W, 0603; Manufacturer: Yageo America; CompType: Resistor; Value: 0; Value_Code: 0000; Tolerance_%: 5; Power_W: 0.1; Value2: 0.1W; VDC_V: 50; TempCo: 200 ppm/C; SizeArea_mm2: 1.28; SizeX_mm: 1.6; SizeY_mm: 0.8; SizeZ_mm: 1; EIA_Code: E24; U/M: EA; AEC Category: Q200; SymbolVersion: 2009-05-29; PartNumber: RC0603JR-070RL; PackageReference: 0603; RoHS: Y; Res_ohm: 0; Value1: 5%; MountType: SMT; Technology: Thick Film; Published: 2008-06-26; Publisher: Texas Instruments; LatestRevisionDate: 2017-03-04; ComponentLink1Description: Datasheet link; ComponentLink1URL: http://www.yageo.com/pdf/Pu-RC0603_51_PbFree_L_2.pdf; Supplier 1: Digi-Key; Supplier Part Number 1: 311-0.0GRCT-ND; Supplier 2: Mouser; Supplier Part Number 2: 603-RC0603JR-070RL; Supplier 3: Farnell; Supplier Part Number 3: 9233130; AEC Qualified: ?
R4 R9 = RC1206FR-0710RL: RES, 10.0, 1%, 0.25 W, 1206; Manufacturer: Yageo America; CompType: Resistor; Value: 10.0; Res_ohm: 10; Value_Code: 10R0; Tolerance_%: 1; Power_W: 0.25; Value2: 0.25W; VDC_V: 200; TempCo: 200 ppm/C; SizeArea_mm2: 5.12; SizeX_mm: 3.2; SizeY_mm: 1.6; SizeZ_mm: 1.35; EIA_Code: E96; U/M: EA; AEC Category: Q200; SymbolVersion: 2009-05-29; PartNumber: RC1206FR-0710RL; PackageReference: 1206; RoHS: Y; Value1: 1%; MountType: SMT; Technology: Thick Film; Published: 2008-06-26; Publisher: Texas Instruments; LatestRevisionDate: 2017-03-10; ComponentLink1Description: Datasheet link; ComponentLink1URL: http://www.yageo.com/pdf/Pu-RC1206_51_PbFree_L_2.pdf; Supplier 1: Digi-Key; Supplier Part Number 1: 311-10.0FRCT-ND; Supplier 2: Mouser; Supplier Part Number 2: 603-RC1206FR-0710RL; Supplier 3: Farnell; Supplier Part Number 3: 9236643; AEC Qualified: ?
R6 = Y14880R01000B9R: Current Sense Resistors - SMD 0.005ohms 0.1% 3w; Manufacturer: Vishay Foil Resistors; Value: 5mOhm; Value_Code: R010; Tolerance_%: 0.1; Power_W: 3; TempCo: 15 ppm/C; SizeArea_mm2: 85.935312; SizeAreaWB_mm2: 127.019312; SizeX_mm: 9.398; SizeY_mm: 9.144; SizeZ_mm: 0.889; U/M: EA; AEC Category: Q200; AEC Qualified: N; CompType: Resistor; SymbolVersion: 2009-05-29; PartNumber: Y14880R00500B9R; PackageReference: 9.398x9.144mm; RoHS: Y; Res_ohm: 5mOhm; Value1: 0.1%; Value2: 3W; MountType: SMT; Technology: Metal Foil; Published: 2008-06-26; Publisher: Texas Instruments; LatestRevisionDate: 2017-06-19; ComponentLink1Description: Datasheet link; ComponentLink1URL: http://www.vishaypg.com/docs/63089/csm.pdf; Supplier 2: Mouser; Supplier Part Number 2: 71-CSM36370R0050BST; AEC Grade: N/A
R7 R10 R12-R14 R17 R20 R31 R34 R36 R39 R40 R68 R73 R74 R185 R290 = CRCW04020000Z0ED: RES, 0, 5%, 0.063 W, 0402; Manufacturer: Vishay-Dale; CompType: Resistor; Value: 0; Value_Code: 0000; Tolerance_%: 5; Power_W: 0.063; Value2: 0.063W; VDC_V: 50; TempCo: 200 ppm/C; SizeArea_mm2: 0.5; SizeX_mm: 1; SizeZ_mm: 0.6; EIA_Code: E24; U/M: EA; AEC Category: Q200; Green_Lifecycle: Active; Green_REACh: Passed; SymbolVersion: 2009-05-29; PartNumber: CRCW04020000Z0ED; PackageReference: 0402; RoHS: Y; Res_ohm: 0; Value1: 5%; MountType: SMT; Technology: Thick Film; SizeY_mm: 0.5; Published: 2008-06-26; Publisher: Texas Instruments; LatestRevisionDate: 2017-06-12; ComponentLink1Description: Datasheet link; ComponentLink1URL: http://www.vishay.com/docs/20035/dcrcwe3.pdf; Supplier 1: Digi-Key; Supplier Part Number 1: 541-0.0JCT-ND; Supplier 2: Newark; Supplier Part Number 2: 52K6543; Supplier 3: Mouser; Supplier Part Number 3: 71-CRCW0402-0-E3; AEC Qualified: ?; Green_EU RoHS: Passed with Exemption; Green_EU RoHS-2: Passed
R11 R21 R62 = CRCW06032R00FKEA: RES, 2.00, 1%, 0.1 W, 0603; Manufacturer: Vishay-Dale; CompType: Resistor; Value: 2.00; Res_ohm: 2; Value_Code: 2R00; Tolerance_%: 1; Power_W: 0.1; Value2: 0.1W; VDC_V: 75; TempCo: 100 ppm/C; SizeArea_mm2: 1.28; SizeX_mm: 1.6; SizeY_mm: 0.8; EIA_Code: E96; U/M: EA; AEC Category: Q200; Green_Lifecycle: Active; Green_REACh: Passed; SymbolVersion: 2009-05-29; PartNumber: CRCW06032R00FKEA; PackageReference: 0603; RoHS: Y; Value1: 1%; MountType: SMT; Technology: Thick Film; SizeZ_mm: 1; Published: 2008-06-26; Publisher: Texas Instruments; LatestRevisionDate: 2017-06-13; ComponentLink1Description: Datasheet link; ComponentLink1URL: http://www.vishay.com/docs/20035/dcrcwe3.pdf; Supplier 1: Digi-Key; Supplier Part Number 1: 541-2.00HHCT-ND; Supplier 2: Mouser; Supplier Part Number 2: 71-CRCW06032R00FKEA; Supplier 3: Farnell; Supplier Part Number 3: 1862038; AEC Qualified: ?; Green_EU RoHS: Passed with Exemption; Green_EU RoHS-2: Passed
R15 R336 R337 = CRCW06031M00FKEA: RES, 1.00 M, 1%, 0.1 W, 0603; Manufacturer: Vishay-Dale; CompType: Resistor; Value: 1.00Meg; Res_ohm: 1000000; Value_Code: 1M00; Tolerance_%: 1; Power_W: 0.1; Value2: 0.1W; VDC_V: 75; TempCo: 100 ppm/C; SizeArea_mm2: 1.28; SizeX_mm: 1.6; SizeY_mm: 0.8; EIA_Code: E96; U/M: EA; AEC Category: Q200; Green_Lifecycle: Active; Green_REACh: Passed; SymbolVersion: 2009-05-29; PartNumber: CRCW06031M00FKEA; PackageReference: 0603; RoHS: Y; Value1: 1%; MountType: SMT; Technology: Thick Film; SizeZ_mm: 1; Published: 2008-06-26; Publisher: Texas Instruments; LatestRevisionDate: 2017-06-13; ComponentLink1Description: Datasheet link; ComponentLink1URL: http://www.vishay.com/docs/20035/dcrcwe3.pdf; Supplier 1: Digi-Key; Supplier Part Number 1: 541-1.00MHCT-ND; Supplier 2: Newark; Supplier Part Number 2: 52K8053; Supplier 3: Mouser; Supplier Part Number 3: 71-CRCW0603-1.0M-E3; AEC Qualified: ?; Green_EU RoHS: Passed with Exemption; Green_EU RoHS-2: Passed
R16 R63 R77 R291 = CRCW060349K9FKEA: RES, 49.9 k, 1%, 0.1 W, 0603; Manufacturer: Vishay-Dale; CompType: Resistor; Value: 49.9k; Res_ohm: 49900; Value_Code: 49k9; Tolerance_%: 1; Power_W: 0.1; Value2: 0.1W; VDC_V: 75; TempCo: 100 ppm/C; SizeArea_mm2: 1.28; SizeX_mm: 1.6; SizeY_mm: 0.8; EIA_Code: E96; U/M: EA; AEC Category: Q200; Green_Lifecycle: Active; Green_REACh: Passed; SymbolVersion: 2009-05-29; PartNumber: CRCW060349K9FKEA; PackageReference: 0603; RoHS: Y; Value1: 1%; MountType: SMT; Technology: Thick Film; SizeZ_mm: 1; Published: 2008-06-26; Publisher: Texas Instruments; LatestRevisionDate: 2017-06-13; ComponentLink1Description: Datasheet link; ComponentLink1URL: http://www.vishay.com/docs/20035/dcrcwe3.pdf; Supplier 1: Digi-Key; Supplier Part Number 1: 541-49.9KHCT-ND; Supplier 2: Mouser; Supplier Part Number 2: 71-CRCW0603-49.9K-E3; Supplier 3: Farnell; Supplier Part Number 3: 1652882; AEC Qualified: ?; Green_EU RoHS: Passed with Exemption; Green_EU RoHS-2: Passed
R19 R25 R75 = Resistor: RES, 1.00, 1%, 0.1 W, 0603; Manufacturer: Yageo; Power_W: 100mW; TempCo: 200 ppm/C; Value_Code: 1R00; Value: 1.00; EIA_Code: E96; SizeX_mm: 1.6; SizeY_mm: 0.8; Value2: 0.1W; SizeArea_mm2: 1.28; AEC Qualified: N; VDC_V: 75V; AEC Category: Q200; SizeAreaWB_mm2: 4.68; ComponentLink1URL: http://www.yageo.com/pdf/Pu-RC0603_51_PbFree_L_2.pdf; Supplier Part Number 2: 603-RC0603FR-071RL; Supplier 2: Mouser; Supplier Part Number 3: 9238123; Supplier 3: Farnell; RoHS: Y; Value1: 1%; MountType: SMT; Supplier 1: Digi-Key; PackageReference: 0603; Tolerance_%: 1%; Res_ohm: 1; SizeZ_mm: 1; CompType: Resistor; PartNumber: RC0603FR-071RL; ComponentLink1Description: Datasheet link; Supplier Part Number 1: 311-1.00HRCT-ND; Technology: Thick Film; AEC Grade: N/A
R28 R29 = RG1608P-102-B-T5: RES, 1.00 k, 0.1%, 0.1 W, 0603; Manufacturer: Susumu Co Ltd; CompType: Resistor; Value: 1.00k; Res_ohm: 1000; Value_Code: 1k00; Tolerance_%: 0.1; Value2: 0.1W; VDC_V: 75; TempCo: 25 ppm/C; EIA_Code: E192; U/M: EA; SymbolVersion: 2009-05-29; PartNumber: RG1608P-102-B-T5; PackageReference: 0603; RoHS: Y; Value1: 0.1%; Power_W: 0.1; MountType: SMT; Technology: Metal Film; Published: 2008-06-26; Publisher: Texas Instruments; LatestRevisionDate: 2015-06-13; ComponentLink1Description: Datasheet link; ComponentLink1URL: http://www.susumu.co.jp/english/pdf/products-j01-01.pdf; Supplier 1: Digi-Key; Supplier Part Number 1: RG16P1.0KBCT-ND; Supplier 2: Mouser; Supplier Part Number 2: 754-RG1608P-102-B-T5; Supplier 3: Farnell; Supplier Part Number 3: 1797076
R30 = Resistor: RES, 2.18 k, 0.1%, 0.1 W, 0603; Manufacturer: Yageo America; Power_W: 100mW; TempCo: 25 ppm/C; Value_Code: 2k18; U/M: EA; Value: 2.18k; EIA_Code: E192; SizeX_mm: 1.6; SizeY_mm: 0.8; SizeZ_mm: 1; Value2: 0.1W; SizeArea_mm2: 1.28; VDC_V: 75V; AEC Category: Q200; ComponentLink1URL: http://www.yageo.com/pdf/PYu-RT_1-to-0.05_RoHS_L_3.pdf; Publisher: Texas Instruments; Published: 2008-06-26; RoHS: Y; Value1: 0.1%; MountType: SMT; PackageReference: 0603; Tolerance_%: 0.1%; Res_ohm: 2.18k; CompType: Resistor; LatestRevisionDate: 2017-03-09; PartNumber: RT0603BRD072K18L; AEC Qualified: ?; ComponentLink1Description: Datasheet link; Technology: Thin Film
R32 R67 R302 = CRCW04022K70JNED: RES, 2.7 k, 5%, 0.063 W, 0402; Manufacturer: Vishay-Dale; CompType: Resistor; Value: 2.7k; Res_ohm: 2700; Value_Code: 2k70; Tolerance_%: 5; Power_W: 0.063; Value2: 0.063W; VDC_V: 50; TempCo: 200 ppm/C; SizeArea_mm2: 0.5; SizeX_mm: 1; SizeZ_mm: 0.6; EIA_Code: E24; U/M: EA; AEC Category: Q200; Green_Lifecycle: Active; Green_REACh: Passed; SymbolVersion: 2009-05-29; PartNumber: CRCW04022K70JNED; PackageReference: 0402; RoHS: Y; Value1: 5%; MountType: SMT; Technology: Thick Film; SizeY_mm: 0.5; Published: 2008-06-26; Publisher: Texas Instruments; LatestRevisionDate: 2017-06-12; ComponentLink1Description: Datasheet link; ComponentLink1URL: http://www.vishay.com/docs/20035/dcrcwe3.pdf; Supplier 1: Digi-Key; Supplier Part Number 1: 541-2.7KJCT-ND; Supplier 2: Newark; Supplier Part Number 2: 72M6761; Supplier 3: Mouser; Supplier Part Number 3: 71-CRCW0402J-2.7K-E3; AEC Qualified: ?; Green_EU RoHS: Passed with Exemption; Green_EU RoHS-2: Passed
R33 R38 R61 R71 = CRCW04025K10JNED: RES, 5.1 k, 5%, 0.063 W, 0402; Manufacturer: Vishay-Dale; CompType: Resistor; Value: 5.1k; Res_ohm: 5100; Value_Code: 5k10; Tolerance_%: 5; Power_W: 0.063; Value2: 0.063W; VDC_V: 50; TempCo: 200 ppm/C; SizeArea_mm2: 0.5; SizeX_mm: 1; SizeZ_mm: 0.6; EIA_Code: E24; U/M: EA; AEC Category: Q200; Green_Lifecycle: Active; Green_REACh: Passed; SymbolVersion: 2009-05-29; PartNumber: CRCW04025K10JNED; PackageReference: 0402; RoHS: Y; Value1: 5%; MountType: SMT; Technology: Thick Film; SizeY_mm: 0.5; Published: 2008-06-26; Publisher: Texas Instruments; LatestRevisionDate: 2017-06-12; ComponentLink1Description: Datasheet link; ComponentLink1URL: http://www.vishay.com/docs/20035/dcrcwe3.pdf; Supplier 1: Digi-Key; Supplier Part Number 1: 541-5.1KJCT-ND; Supplier 2: Newark; Supplier Part Number 2: 72M6798; Supplier 3: Mouser; Supplier Part Number 3: 71-CRCW0402J-5.1K-E3; AEC Qualified: ?; Green_EU RoHS: Passed with Exemption; Green_EU RoHS-2: Passed
R35 R65 R69 = CRCW04027K50FKED: RES, 7.50 k, 1%, 0.063 W, 0402; Manufacturer: Vishay-Dale; CompType: Resistor; Value: 7.50k; Res_ohm: 7500; Value_Code: 7k50; Tolerance_%: 1; Power_W: 0.063; Value2: 0.063W; VDC_V: 50; TempCo: 100 ppm/C; SizeArea_mm2: 0.5; SizeZ_mm: 0.6; EIA_Code: E96; U/M: EA; AEC Category: Q200; Green_Lifecycle: Active; Green_REACh: Passed; SymbolVersion: 2009-05-29; PartNumber: CRCW04027K50FKED; PackageReference: 0402; RoHS: Y; Value1: 1%; MountType: SMT; Technology: Thick Film; SizeX_mm: 1; SizeY_mm: 0.5; Published: 2008-06-26; Publisher: Texas Instruments; LatestRevisionDate: 2017-06-12; ComponentLink1Description: Datasheet link; ComponentLink1URL: http://www.vishay.com/docs/20035/dcrcwe3.pdf; Supplier 1: Digi-Key; Supplier Part Number 1: 541-7.50KLCT-ND; Supplier 2: Newark; Supplier Part Number 2: 52K7245; Supplier 3: Mouser; Supplier Part Number 3: 71-CRCW0402-7.5K-E3; AEC Qualified: ?; Green_EU RoHS: Passed with Exemption; Green_EU RoHS-2: Passed
R37 R66 R287 = CRCW040211K0FKED: RES, 11.0 k, 1%, 0.063 W, 0402; Manufacturer: Vishay-Dale; CompType: Resistor; Value: 11.0k; Res_ohm: 11000; Value_Code: 11k0; Tolerance_%: 1; Power_W: 0.063; Value2: 0.063W; VDC_V: 50; TempCo: 100 ppm/C; SizeArea_mm2: 0.5; SizeZ_mm: 0.6; EIA_Code: E96; U/M: EA; AEC Category: Q200; SymbolVersion: 2009-05-29; PartNumber: CRCW040211K0FKED; PackageReference: 0402; RoHS: Y; Value1: 1%; MountType: SMT; Technology: Thick Film; SizeX_mm: 1; SizeY_mm: 0.5; Published: 2008-06-26; Publisher: Texas Instruments; LatestRevisionDate: 2017-06-12; ComponentLink1Description: Datasheet link; ComponentLink1URL: http://www.vishay.com/docs/20035/dcrcwe3.pdf; Supplier 1: Digi-Key; Supplier Part Number 1: 541-11.0KLCT-ND; Supplier 2: Newark; Supplier Part Number 2: 52K6621; Supplier 3: Mouser; Supplier Part Number 3: 71-CRCW0402-11K-E3; AEC Qualified: ?
R64 R70 = Resistor: RES, 100 k, 0.1%, 0.1 W, 0603; Manufacturer: Yageo America; Power_W: 100mW; TempCo: 25 ppm/C; U/M: EA; Value: 100k; EIA_Code: E192; SizeX_mm: 1.6; SizeY_mm: 0.8; SizeZ_mm: 1; Value2: 0.1W; SizeArea_mm2: 1.28; VDC_V: 75V; AEC Category: Q200; Publisher: Texas Instruments; Published: 2008-06-26; Value_Code: 100k; RoHS: Y; Value1: 0.1%; MountType: SMT; Supplier 1: Mouser; PackageReference: 0603; Tolerance_%: 0.1%; Res_ohm: 100k; CompType: Resistor; LatestRevisionDate: 2017-03-09; PartNumber: RT0603BRD07100KL; AEC Qualified: ?; ComponentLink1Description: Datasheet link; Supplier Part Number 1: 603-RT0603BRD07100KL; Technology: Thin Film; ComponentLink1URL: http://www.yageo.com/pdf/PYu-RT_1-to-0.05_RoHS_L_3.pdf
R72 = Resistor: RES, 32.0 k, 0.1%, 0.1 W, 0603; Manufacturer: Yageo America; Power_W: 100mW; TempCo: 25 ppm/C; Value_Code: 24k0; U/M: EA; Value: 32k; SizeX_mm: 1.6; SizeY_mm: 0.8; SizeZ_mm: 1; Value2: 0.1W; SizeArea_mm2: 1.28; VDC_V: 75V; AEC Category: Q200; EIA_Code: E192; Publisher: Texas Instruments; Published: 2008-06-26; RoHS: Y; Value1: 0.1%; MountType: SMT; PackageReference: 0603; Tolerance_%: 0.1%; Res_ohm: 32k; CompType: Resistor; LatestRevisionDate: 2017-03-09; PartNumber: RN731JTTD3202B25; AEC Qualified: ?; Technology: Thin Film; Supplier 1: Mouser; Supplier Part Number 1: 660-RN731JTTD3202B25
R76 = CRCW06034K99FKEA: RES, 4.99 k, 1%, 0.1 W, 0603; Manufacturer: Vishay-Dale; CompType: Resistor; Value: 4.99k; Res_ohm: 4990; Value_Code: 4k99; Tolerance_%: 1; Power_W: 0.1; Value2: 0.1W; VDC_V: 75; TempCo: 100 ppm/C; EIA_Code: E96; U/M: EA; SymbolVersion: 2009-05-29; PartNumber: CRCW06034K99FKEA; PackageReference: 0603; RoHS: Y; Value1: 1%; MountType: SMT; Technology: Thick Film; Published: 2008-06-26; Publisher: Texas Instruments; LatestRevisionDate: 2015-06-13; ComponentLink1Description: Datasheet link; ComponentLink1URL: http://www.vishay.com/docs/20035/dcrcwe3.pdf; Supplier 1: Digi-Key; Supplier Part Number 1: 541-4.99KHCT-ND; Supplier 2: Mouser; Supplier Part Number 2: 71-CRCW0603-4.99K-E3; Supplier 3: Farnell; Supplier Part Number 3: 1652885
R216 = RES: RES SMD 1K OHM 0.1% 1/10W 0603; Manufacturer: Yageo; Temperature Coefficient: 50ppm/°C; Power Rating: 100mW; Voltage Rating (DC): 50V; Part Number: RT0603BRE071KL; Supplier 1: Digi-Key; Supplier Part Number 1: YAG2314CT-ND; Manufacturer Part Number: RT0603BRE071KL; RoHS: Yes; Category: Chip SMD Resistors; Stock 1: 10508; Pricing 1: 1=0.38000, 10=0.27500, 100=0.11000, 1000=0.05420, 2500=0.05021 (USD); Case/Package: 0603; Case Code (Metric): 1608; Case Code (Imperial): 0603; Min Operating Temperature: -55°C; Max Operating Temperature: 155°C; Packaging: Tape and Reel; Resistor Type: Thin Film; Number of Terminations: 2; Package Quantity: 5000; Max Power Dissipation: 100mW; Features: Moisture Resistant; Length: 0.063inch; Width: 0.031inch; Height: 0.022inch; Depth: 0.8mm; Lead Free: Lead Free; Military Standard: Not; ComponentLink1URL: https://datasheet.ciiva.com/2584/pyu-rt-1-to-0-05-rohs-l-5-2584317.pdf?src-supplier=Digi-Key; ComponentLink1Description: https://datasheet.ciiva.com/2584/pyu-rt-1-to-0-05-rohs-l-5-2584317.pdf?src-supplier=Digi-Key; PartNumber: RT0603BRE071KL; Size Code: 0603; Series: RT; Construction: Rectangular; RoHS Compliant: Yes
R217 = RES: RES SMD 560 OHM 0.1% 1/10W 0603; Manufacturer: Yageo; Temperature Coefficient: 25ppm/°C; Power Rating: 100mW; Voltage Rating: 75V; Voltage Rating (DC): 50V; Part Number: RT0603BRD07560RL; Supplier 1: Digi-Key; Supplier Part Number 1: YAG1689CT-ND; Manufacturer Part Number: RT0603BRD07560RL; RoHS: Yes; Category: Chip SMD Resistors; Stock 1: 3184; Pricing 1: 1=0.32000, 10=0.27400, 100=0.10730, 1000=0.04491, 2500=0.04117 (USD); Case/Package: 0603; Contact Plating: Tin,Matte; Case Code (Metric): 1608; Case Code (Imperial): 0603; Weight: 7.1E-05oz; Min Operating Temperature: -55°C; Max Operating Temperature: 125°C; Resistor Type: Thin Film; Package Quantity: 5000; Packaging: Tape and Reel; Number of Terminations: 2; Termination: SMD/SMT; Max Power Dissipation: 100mW; Features: Moisture Resistant; Length: 1.6mm; Width: 0.031inch; Height: 0.022inch; Depth: 0.8mm; Radiation Hardening: No; Military Standard: Not; Lead Free: Lead Free; ComponentLink1URL: https://datasheet.ciiva.com/2586/pyu-rt-1-to-0-05-rohs-l-4-2586000.pdf?src-supplier=Digi-Key; ComponentLink1Description: https://datasheet.ciiva.com/2586/pyu-rt-1-to-0-05-rohs-l-4-2586000.pdf?src-supplier=Digi-Key; ComponentLink2URL: https://datasheet.ciiva.com/8885/pyu-rt-1-to-0-05-rohs-l-4-8885271.pdf?src-supplier=Avnet; ComponentLink2Description: https://datasheet.ciiva.com/8885/pyu-rt-1-to-0-05-rohs-l-4-8885271.pdf?src-supplier=Avnet; ComponentLink3URL: https://datasheet.ciiva.com/46635/pyu-rt-1-to-0-05-rohs-l-5-46635277.pdf?src-supplier=Digi-Key; ComponentLink3Description: https://datasheet.ciiva.com/46635/pyu-rt-1-to-0-05-rohs-l-5-46635277.pdf?src-supplier=Digi-Key; PartNumber: RT0603BRD07560RL; Series: RT; Construction: Rectangular; RoHS Compliant: Yes
R219 = FC0402E50R0BST1: RES, 50, 0.1%, 0.05 W, 0402; Manufacturer: Vishay-Dale; CompType: Resistor; Value: 50; Value_Code: 50R0; Tolerance_%: 0.1; Power_W: 0.05; Value2: 0.05W; TempCo: 25 ppm/C; SizeArea_mm2: 0.5; SizeX_mm: 1; SizeZ_mm: 0.6; U/M: EA; AEC Category: Q200; AEC Qualified: N; SymbolVersion: 2009-05-29; PartNumber: FC0402E50R0BST1; PackageReference: 0402; RoHS: Y; Res_ohm: 50; Value1: 0.1%; MountType: SMT; Technology: Thin Film; SizeY_mm: 0.5; Published: 2008-06-26; Publisher: Texas Instruments; LatestRevisionDate: 2017-06-12; ComponentLink1Description: Datasheet link; ComponentLink1URL: http://www.vishay.com/docs/60093/fcseries.pdf; Supplier 1: Digi-Key; Supplier Part Number 1: FC0402-50BWCT-ND; Supplier 2: Newark; Supplier Part Number 2: 41R5603; Supplier 3: Mouser; Supplier Part Number 3: 71-FC0402E50R0BST1; AEC Grade: N/A
R221 = RES: RES SMD 3k OHM 0.1% 1/10W 0603; Manufacturer: Panasonic; Temperature Coefficient: 25ppm/°C; Power Rating: 62.5mW; Voltage Rating (DC): 75V; Max Power Dissipation: 100mW; Part Number: ERA-3YEB302V; Supplier 1: Digi-Key; Supplier Part Number 1: P3.0KYCT-ND; Manufacturer Part Number: ERA-3YEB302V; RoHS: Yes; Category: Chip SMD Resistors; Stock 1: 369; Pricing 1: 1=0.28000, 10=0.17300, 100=0.10730 (USD); Mount: Surface Mount; Case/Package: 0603; Case Code (Metric): 1608; Case Code (Imperial): 0603; Contact Plating: Tin; Weight: 7.1E-05oz; Min Operating Temperature: -55°C; Max Operating Temperature: 125°C; Packaging: Tape and Reel; Resistor Type: Thin Film,Metal Film; Termination: SMD/SMT; Package Quantity: 1; Number of Terminations: 2; Length: 1.6mm; Width: 0.031inch; Height: 0.022inch; Depth: 0.8mm; Radiation Hardening: No; Lead Free: Lead Free; Military Standard: Not; ComponentLink1URL: http://components.arrow.com/part/dataview/0323_02918288?src-supplier=Arrow+Europe; ComponentLink1Description: http://components.arrow.com/part/dataview/0323_02918288?src-supplier=Arrow+Europe; ComponentLink2URL: https://media.digikey.com/pdf/Data%20Sheets/Panasonic%20Resistors%20Thermistors%20PDFs/ERA3Y_E_Spec.PDF?src-supplier=Digi-Key; ComponentLink2Description: https://media.digikey.com/pdf/Data%20Sheets/Panasonic%20Resistors%20Thermistors%20PDFs/ERA3Y_E_Spec.PDF?src-supplier=Digi-Key; ComponentLink3URL: http://www.alliedelec.com/images/products/datasheets/bm/1_Datasheets/70552202.pdf?src-supplier=Allied+Electronics; ComponentLink3Description: http://www.alliedelec.com/images/products/datasheets/bm/1_Datasheets/70552202.pdf?src-supplier=Allied+Electronics; ComponentLink4URL: http://www.mouser.com/ds/2/315/ERA3Y6Y14-197296.pdf?src-supplier=Mouser; ComponentLink4Description: http://www.mouser.com/ds/2/315/ERA3Y6Y14-197296.pdf?src-supplier=Mouser; ComponentLink5URL: http://components.arrow.com/part/dataview/3988931S9695890N1386?src-supplier=Arrow+Electronics; ComponentLink5Description: http://components.arrow.com/part/dataview/3988931S9695890N1386?src-supplier=Arrow+Electronics; PartNumber: ERA-3YEB302V
RT1#2 = Res Thermal: Thermistor; PartNumber: JST B2B-EH-A; Published: 24-Mar-1999; LatestRevisionDate: 29-May-2009; LatestRevisionNote: IPC-7351 Footprint Added.; PackageVersion: Mar-2003; PackageReference: 6-0805; Publisher: Altium Limited; PackageDescription: Chip Resistor 0805 Case Size; Code_IPC: RESC2012; Supplier 1: RSComponents; Supplier Part Number 1: 5151383
TP1 TP3 TP7-TP10 TP42-TP44 = 5002: Test Point, Miniature, White, TH; Manufacturer: Keystone; CompType: Test Point Loop; ContactFinish: Silver; Green_Lifecycle: Active; Green_REACh: Passed; SymbolVersion: 2008-04-04; PartNumber: 5002; PackageReference: White Miniature Testpoint; RoHS: Y; MountType: TH; ComponentLink1Description: Datasheet URL; ComponentLink1URL: http://www.keyelco.com/userAssets/file/M60-2p60.pdf; Color: White; Publisher: Texas Instruments; LatestRevisionDate: 2017-05-11; Supplier 1: Digi-Key; Supplier Part Number 1: 36-5002-ND; Supplier 2: Newark; Supplier Part Number 2: 82H9632; Supplier 3: Mouser; Supplier Part Number 3: 534-5002; Green_EU RoHS: Passed; Green_EU RoHS-2: Passed
TP2 TP4 TP5 = 5000: Test Point, Miniature, Red, TH; Manufacturer: Keystone; CompType: Test Point Loop; ContactFinish: Silver; Green_Lifecycle: Active; Green_REACh: Passed; SymbolVersion: 2008-04-04; PartNumber: 5000; PackageReference: Red Miniature Testpoint; RoHS: Y; MountType: TH; ComponentLink1Description: Datasheet URL; ComponentLink1URL: http://www.keyelco.com/userAssets/file/M60-2p60.pdf; Color: Red; Publisher: Texas Instruments; LatestRevisionDate: 2017-05-11; Supplier 1: Digi-Key; Supplier Part Number 1: 36-5000-ND; Supplier 2: Mouser; Supplier Part Number 2: 534-5000; Green_EU RoHS: Passed; Green_EU RoHS-2: Incomplete
TP6 = 5001: Test Point, Miniature, Black, TH; Manufacturer: Keystone; CompType: Test Point Loop; ContactFinish: Silver; Green_Lifecycle: Active; Green_REACh: Passed; SymbolVersion: 2008-04-04; PartNumber: 5001; PackageReference: Black Miniature Testpoint; RoHS: Y; MountType: TH; ComponentLink1Description: Datasheet URL; ComponentLink1URL: http://www.keyelco.com/userAssets/file/M60-2p60.pdf; Color: Black; Publisher: Texas Instruments; LatestRevisionDate: 2017-05-11; Supplier 1: Digi-Key; Supplier Part Number 1: 36-5001-ND; Supplier 2: Mouser; Supplier Part Number 2: 534-5001; Green_EU RoHS: Passed; Green_EU RoHS-2: Incomplete
U1 = IN-MOSDRV-LM5107-8: High Voltage 1A Peak Half Bridge Gate Driver, 8-pin Narrow SOIC, Pb-Free; Manufacturer: Texas Instruments; PowerWise: N; CompType: MiscPower; PackageTopMarking: NSZXTT*L5109*BMA; ComponentLink1URL: http://www.ti.com/general/docs/lit/getliterature.tsp?genericPartNumber=LM5109B&fileType=pdf; PackageReference: D0008A; Code_IPC: SOIC127P600-8; PinCount: 8; ComponentLink1Description: Datasheet URL; RoHS: Y; Code_JEDEC: MS-012-AA; PackageDescription: SOIC Narrow, 4.9 x 3.9 x 1.45mm, 8 Lead, 1.27mm Pitch; PartNumber: LM5109BMAX/NOPB